# EasyEDA schematic EasyEda SCH_CAD-Mouse_2025-05-26.json

## Sheets
1 Schematic: TITLE: SpaceMouse ESP32S3 Zero; REV: 1.0; Date: 2025-05-26; Sheet: 1/1; Drawn By: jarnob; Company: Ratatosk
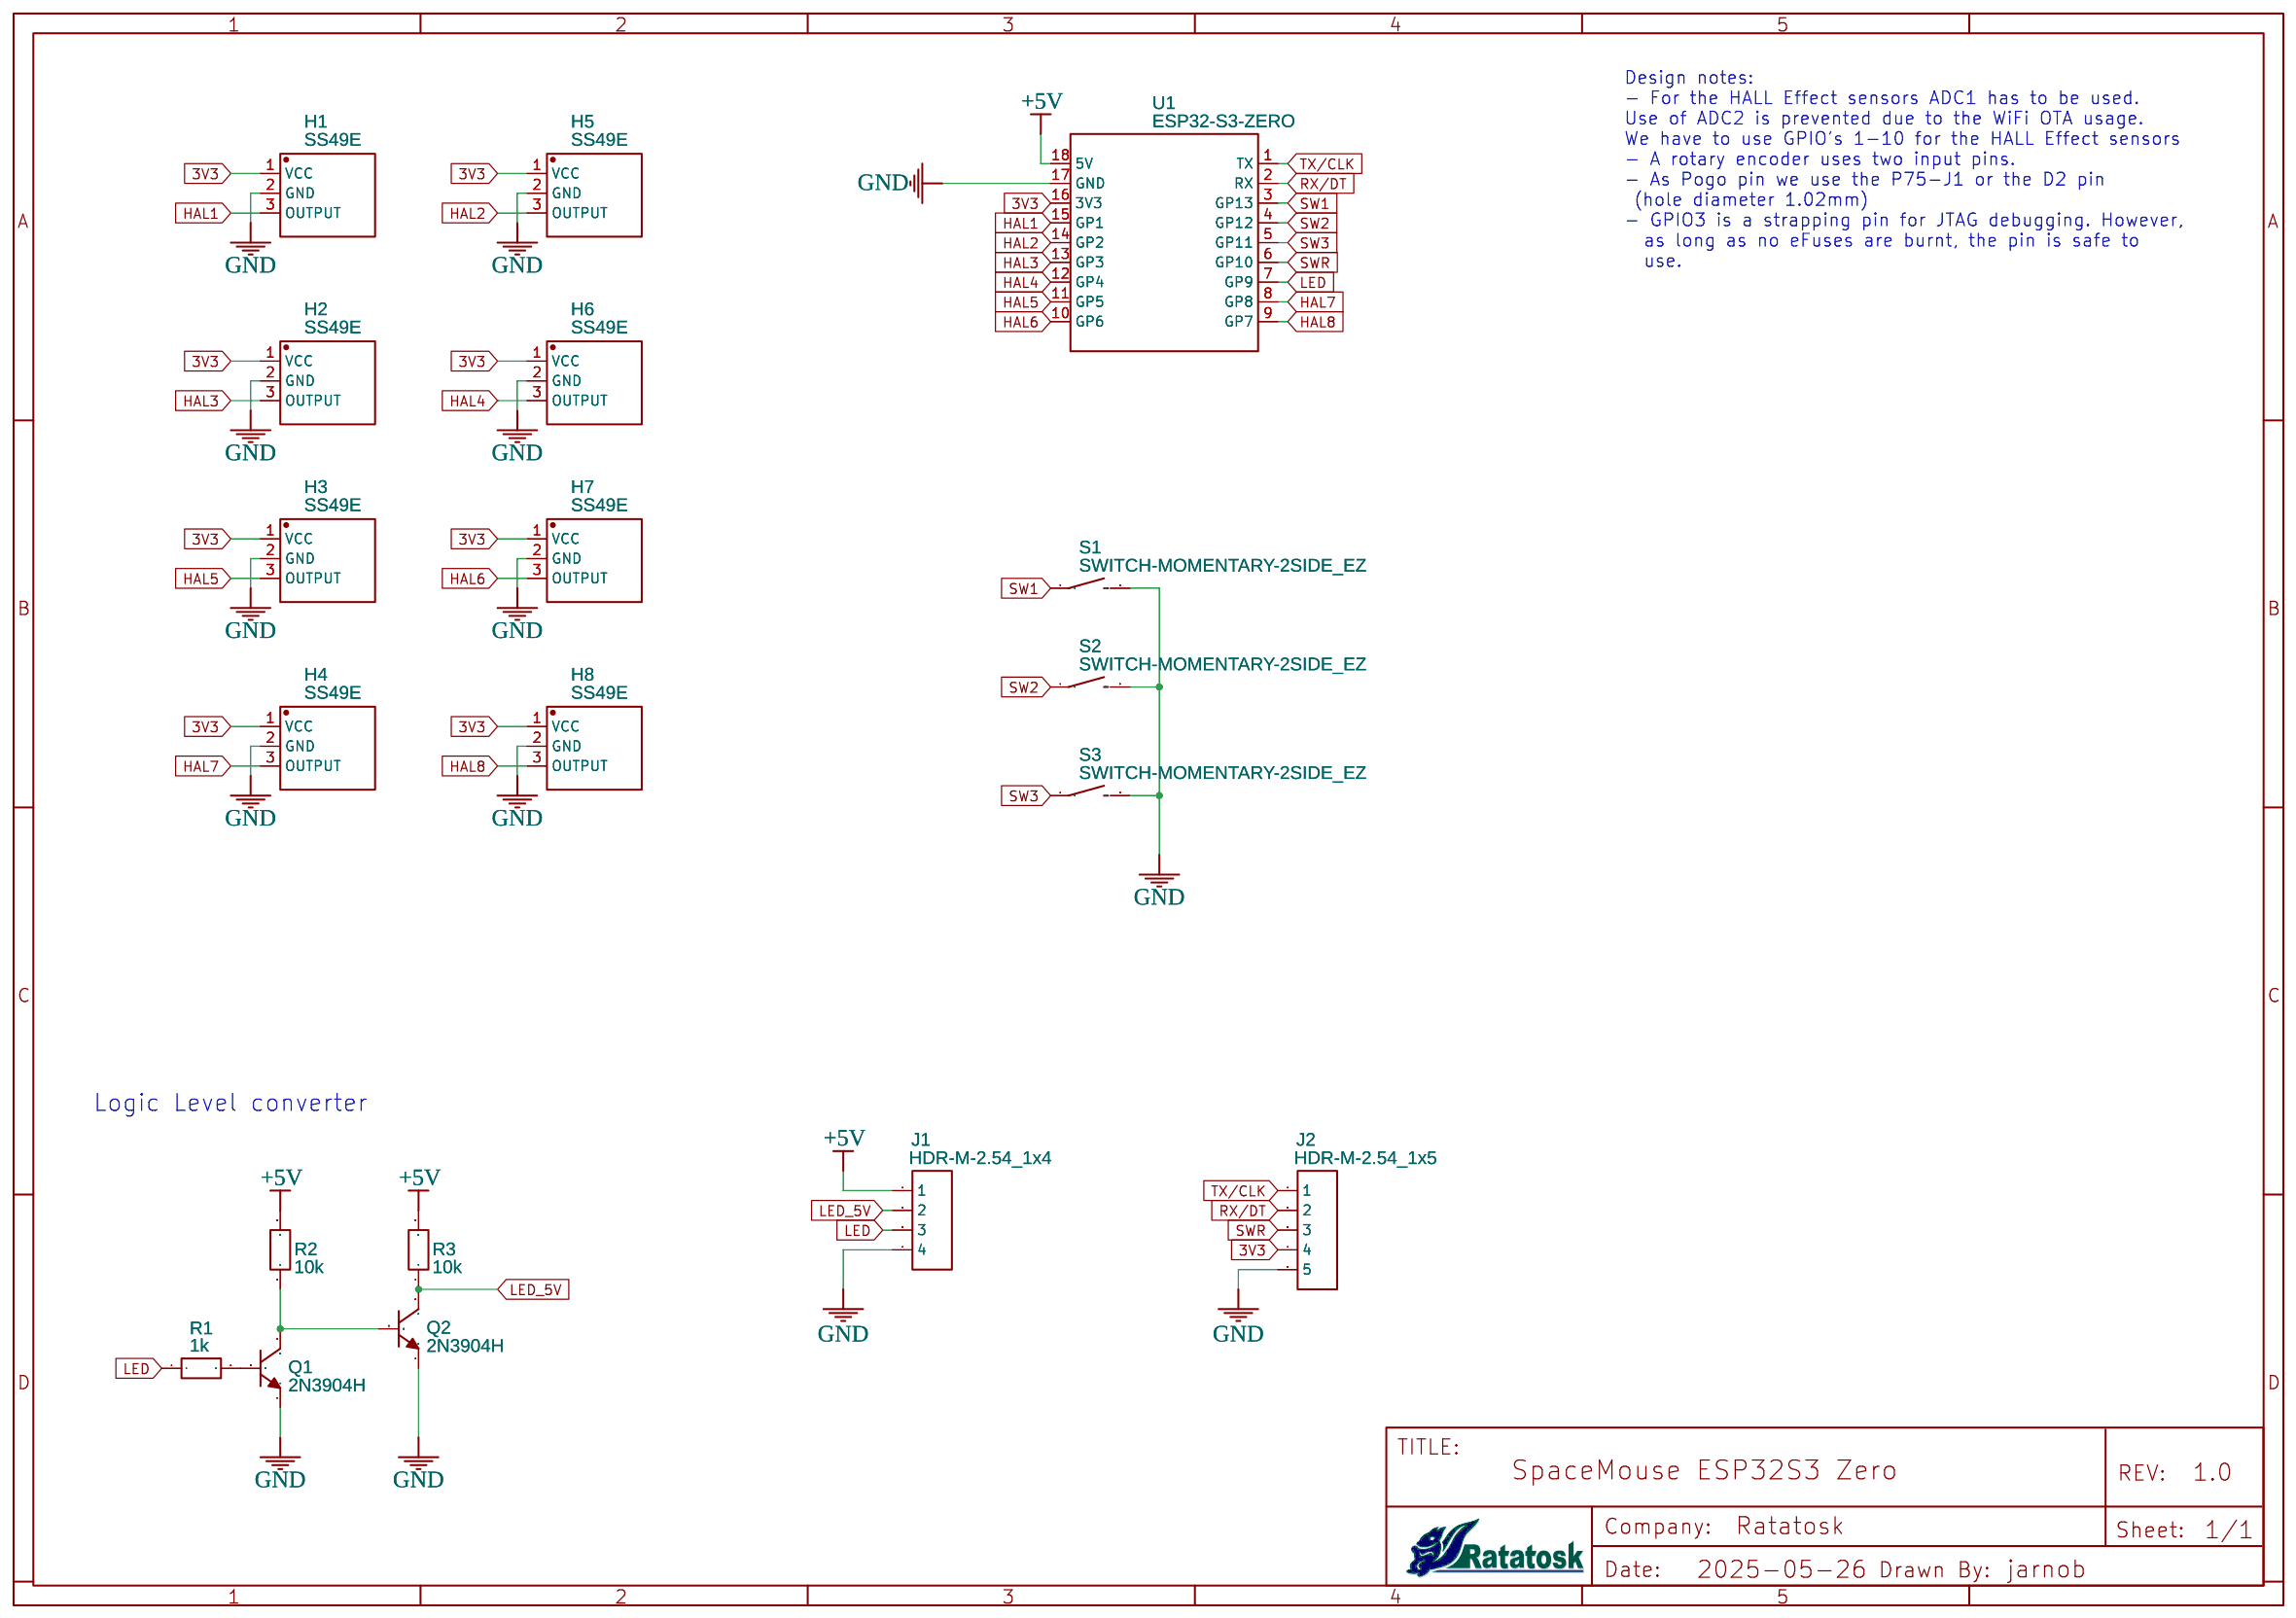
[diagram p0: Schematic]
2 Components: TITLE: Sheet_1; Date: 2025-05-25; Company: Your Company
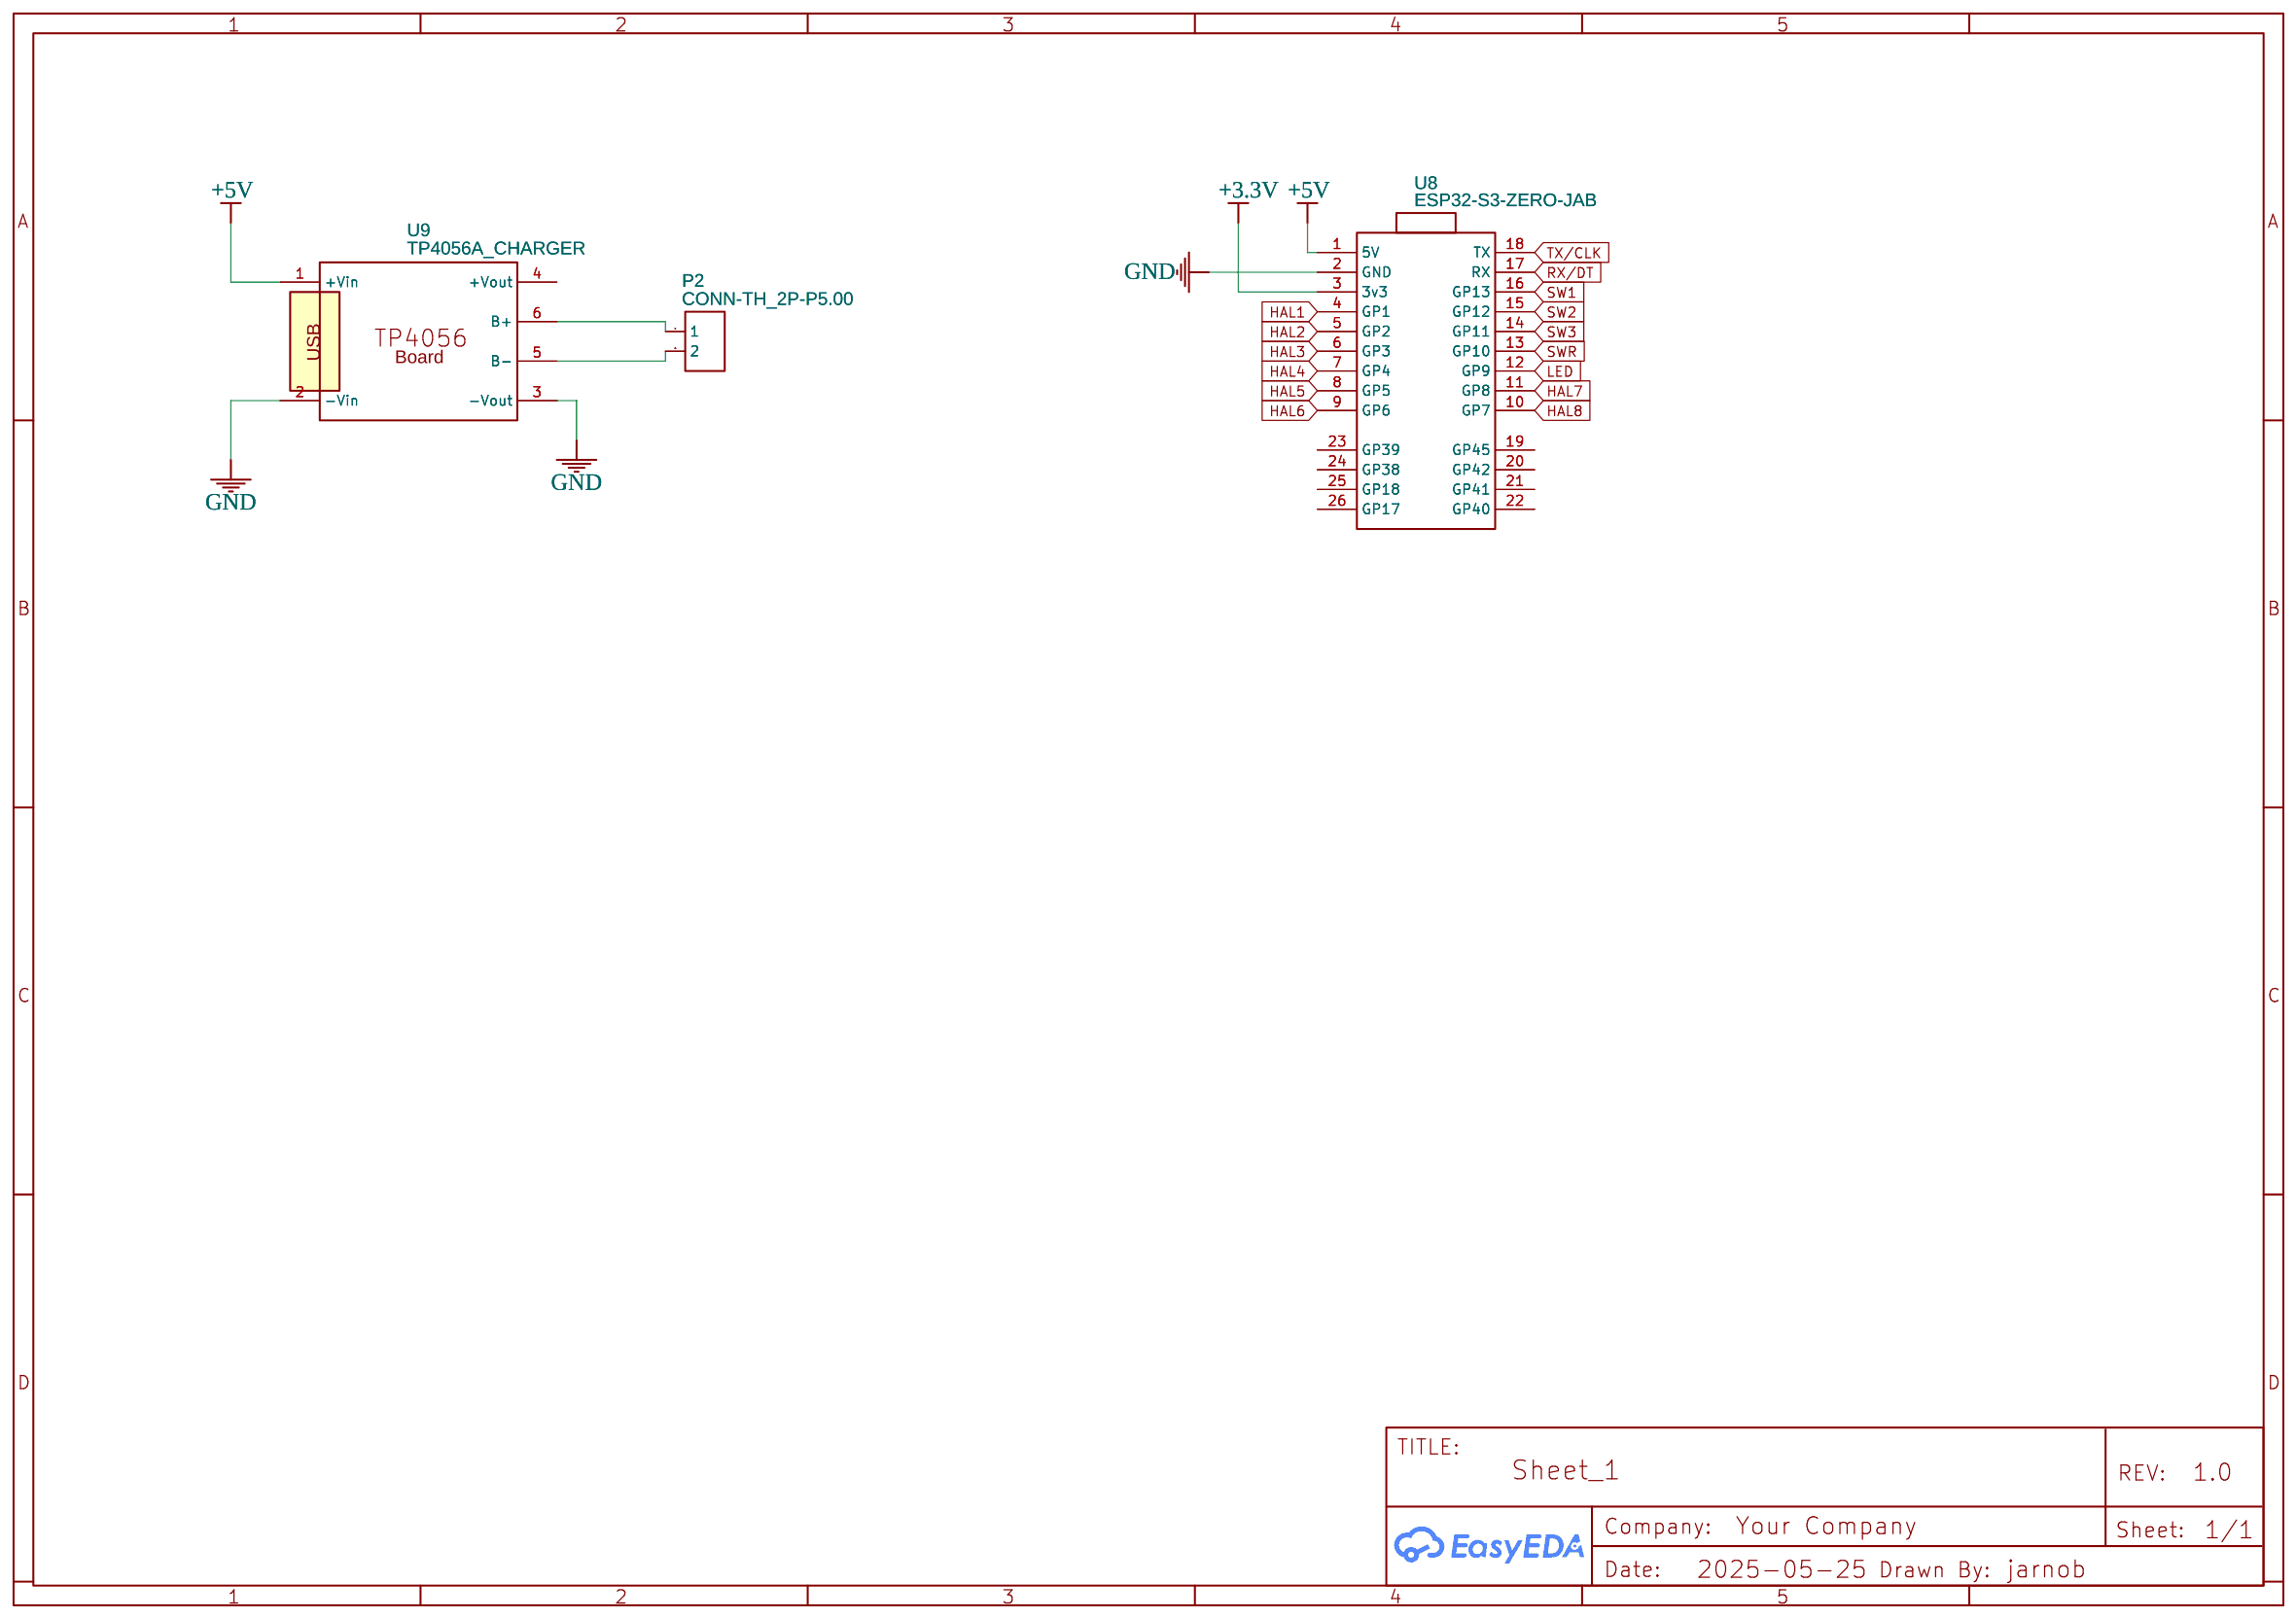
[diagram p1: Components]

## Parts
sheet Components
P2  CONN-TH_2P-P5.00  [CONN-TH_2P-P5.00]
U8  ESP32-S3-ZERO-JAB  [ESP32-S3-ZERO JAB]
U9  TP4056A_CHARGER  [TP4056A_CHARGER_BOARD]
sheet Schematic
H1  SS49E  [SS49EHALL_TO-92FLAT]
H2  SS49E  [SS49EHALL_TO-92FLAT]
H3  SS49E  [SS49EHALL_TO-92FLAT]
H4  SS49E  [SS49EHALL_TO-92FLAT]
H5  SS49E  [SS49EHALL_TO-92FLAT]
H6  SS49E  [SS49EHALL_TO-92FLAT]
H7  SS49E  [SS49EHALL_TO-92FLAT]
H8  SS49E  [SS49EHALL_TO-92FLAT]
J1  HDR-M-2.54_1x4  [HDR-M-2.54_1X4]
J2  HDR-M-2.54_1x5  [HDR-M-2.54_1X5]
Q1  2N3904H  [TO-92-3_L4.8-W3.7-P1.27-L-1]
Q2  2N3904H  [TO-92-3_L4.8-W3.7-P1.27-L-1]
R1  1k  [R_AXIAL-0.3]
R2  10k  [R_AXIAL-0.3]
R3  10k  [R_AXIAL-0.3]
S1  SWITCH-MOMENTARY-2SIDE_EZ  [TACTILE-PTH-SIDEEZ]
S2  SWITCH-MOMENTARY-2SIDE_EZ  [TACTILE-PTH-SIDEEZ]
S3  SWITCH-MOMENTARY-2SIDE_EZ  [TACTILE-PTH-SIDEEZ]
U1  ESP32-S3-ZERO  [ESP_ZERO]

## Library data of the parts
P2 = CONN-TH_2P-P5.00: Supplier: LCSC; Contributor: LCEDA_Lib
U8 = ESP32-S3-ZERO-JAB: Contributor: samahosam
U9 = TP4056A_CHARGER: Manufacturer Part: TP4056A; Supplier: Aliexpress; link: https://www.componentsinfo.com/tp4056-module-pinout-datasheet-details/; Contributor: lucianscripca
H1-H8 = SS49 hall sensor: Contributor: Andrew Melnikov
J1 = HDR-M-2.54_1x4: Supplier Part: C124378; Supplier: LCSC; Contributor: LCEDA_Lib
J2 = HDR-M-2.54_1x5: Supplier Part: C358687; Supplier: LCSC; Contributor: LCEDA_Lib
Q1 Q2 = 2N3904H: Supplier: LCSC; Supplier Part: C3195910; Manufacturer: onsemi(安森美); JLCPCB Part Class: Extended Part; Contributor: lcsc
R1-R3 = R_AXIAL-0.3_EU: Contributor: LCEDA_Lib
S1-S3 = SWITCH-MOMENTARY-2SIDE_EZ: Contributor: Rik Roy
U1 = ESP32-S3-ZERO: Manufacturer: Waveshare; Manufacturer Part: ESP32-S3-Zero; Contributor: lcsc

## Nets
3V3: H1.1(VCC) H2.1(VCC) H3.1(VCC) H4.1(VCC) H5.1(VCC) H6.1(VCC) H7.1(VCC) H8.1(VCC) J2.4 U1.16(3V3)
+3.3V: U8.3(3v3)
+5V: J1.1 R2.2 R3.2 U1.18(5V) U8.1(5V) U9.1(+Vin)
GND: H1.2(GND) H2.2(GND) H3.2(GND) H4.2(GND) H5.2(GND) H6.2(GND) H7.2(GND) H8.2(GND) J1.4 J2.5 Q1.1(E) Q2.1(E) S1.2 S2.2 S3.2 U1.17(GND) U8.2(GND) U9.2(-Vin) U9.3(-Vout)
HAL1: H1.3(OUTPUT) U1.15(GP1) U8.4(GP1)
HAL2: H5.3(OUTPUT) U1.14(GP2) U8.5(GP2)
HAL3: H2.3(OUTPUT) U1.13(GP3) U8.6(GP3)
HAL4: H6.3(OUTPUT) U1.12(GP4) U8.7(GP4)
HAL5: H3.3(OUTPUT) U1.11(GP5) U8.8(GP5)
HAL6: H7.3(OUTPUT) U1.10(GP6) U8.9(GP6)
HAL7: H4.3(OUTPUT) U1.8(GP8) U8.11(GP8)
HAL8: H8.3(OUTPUT) U1.9(GP7) U8.10(GP7)
LED: J1.3 R1.1 U1.7(GP9) U8.12(GP9)
LED_5V: J1.2 Q2.3(C) R3.1
RX/DT: J2.2 U1.2(RX) U8.17(RX)
SW1: S1.1 U1.3(GP13) U8.16(GP13)
SW2: S2.1 U1.4(GP12) U8.15(GP12)
SW3: S3.1 U1.5(GP11) U8.14(GP11)
SWR: J2.3 U1.6(GP10) U8.13(GP10)
TX/CLK: J2.1 U1.1(TX) U8.18(TX)
Net-(P2-1): P2.1 U9.6(B+)
Net-(P2-2): P2.2 U9.5(B-)
Net-(Q1-2): Q1.2(B) R1.2
Net-(Q1-3): Q1.3(C) Q2.2(B) R2.1

Not connected (* = marked no-connect by the designer): U8 19(GP45) 20(GP42) 21(GP41) 22(GP40) 23(GP39) 24(GP38) 25(GP18) 26(GP17); U9 4(+Vout)

## Notes on the sheets
sheet 1
- Design notes:
  - For the HALL Effect sensors ADC1 has to be used.
  Use of ADC2 is prevented due to the WiFi OTA usage.
  We have to use GPIO's 1-10 for the HALL Effect sensors
  - A rotary encoder uses two input pins.
  - As Pogo pin we use the P75-J1 or the D2 pin
   (hole diameter 1.02mm)
  - GPIO3 is a strapping pin for JTAG debugging. However,
    as long as no eFuses are burnt, the pin is safe to
    use.
- Logic Level converter
